# Altium schematic sheet Power_Supply_REV2.SchDoc
size A1; SheetNumber: 3; SheetTotal: 3
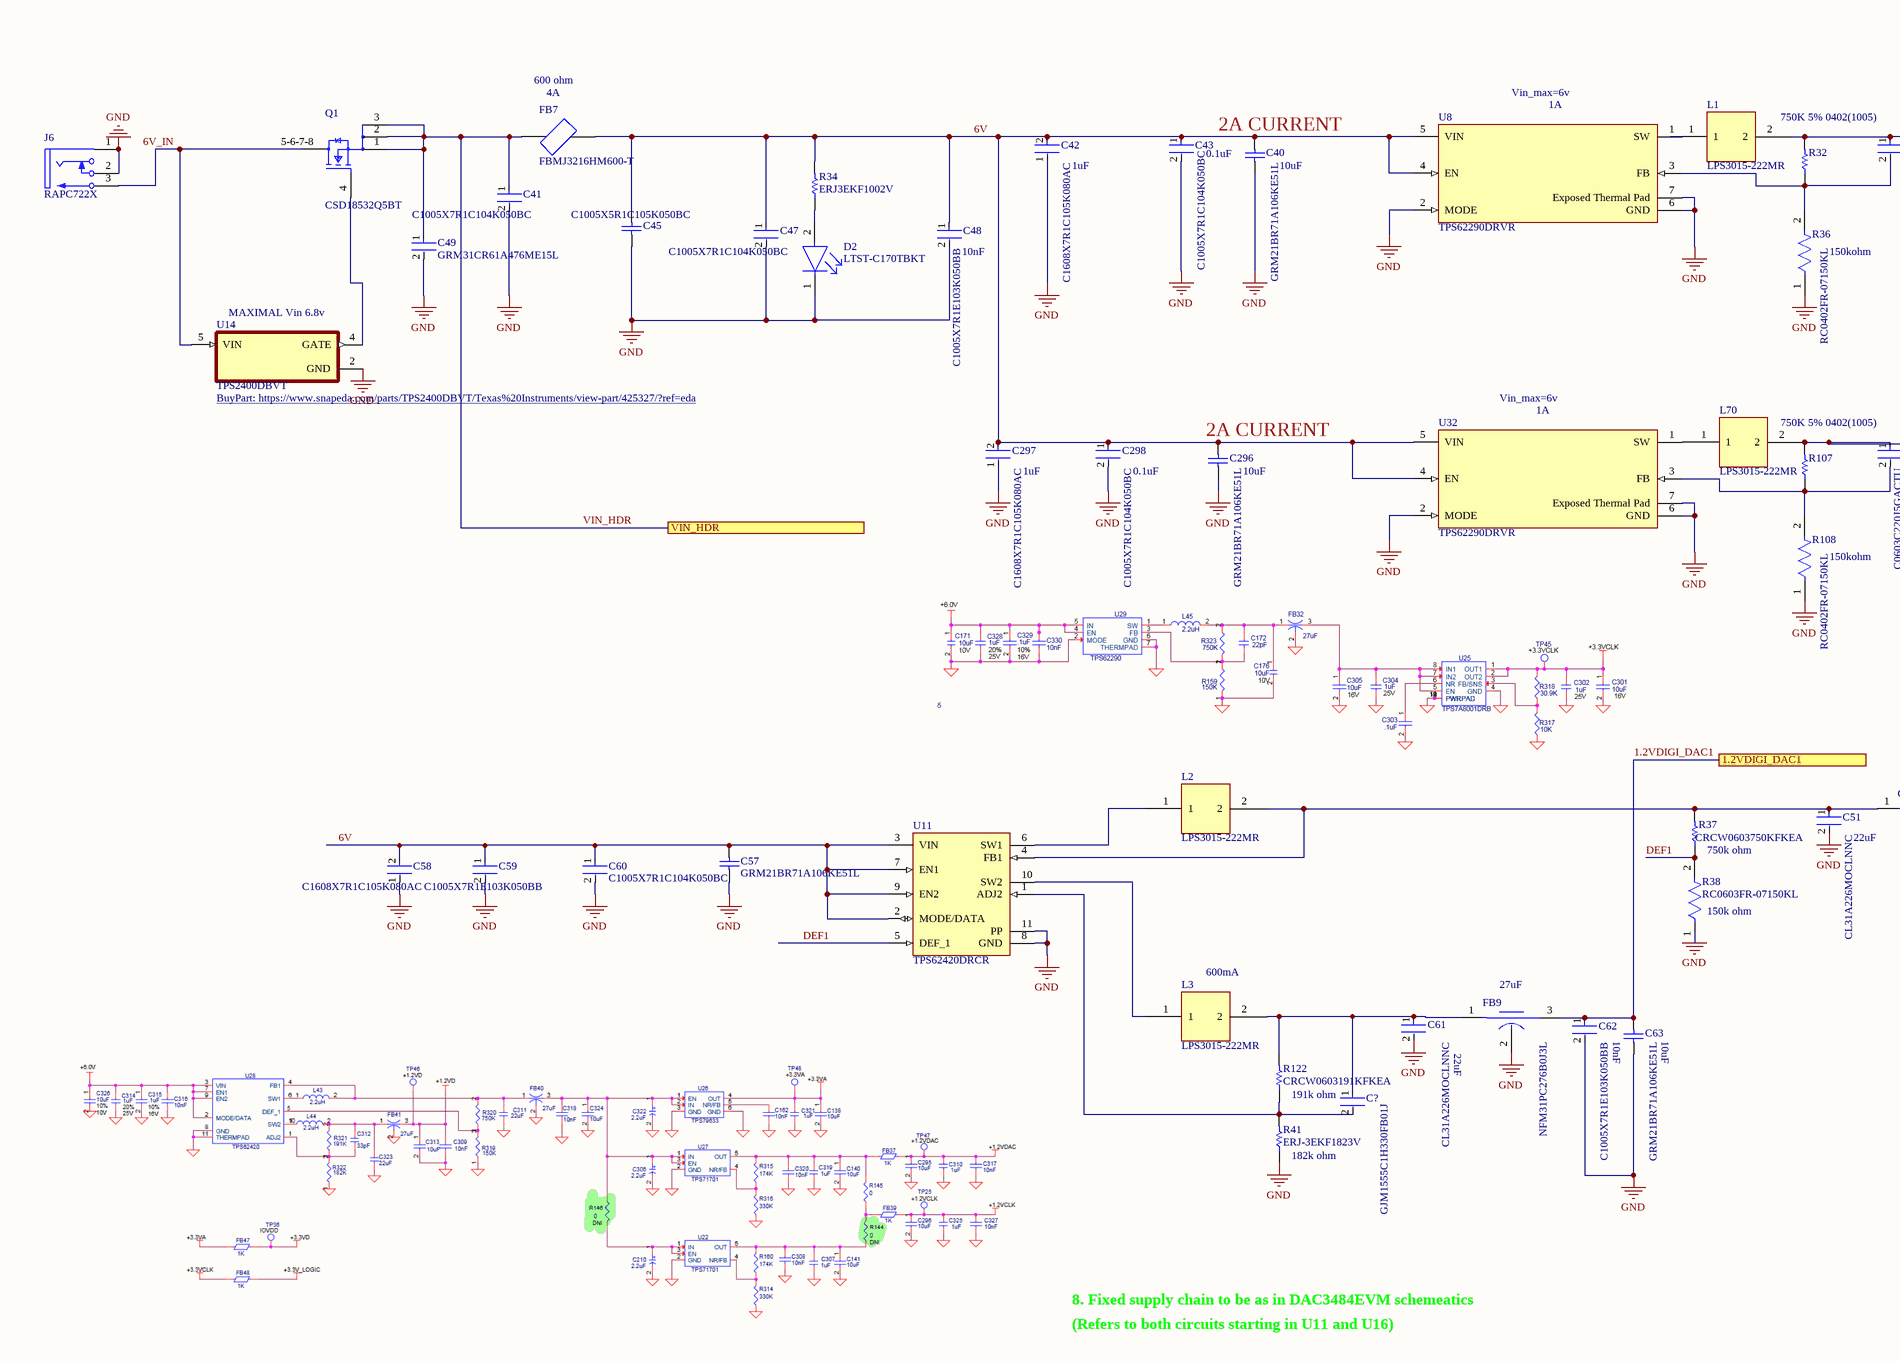
[diagram p0: Power_Supply_REV2.SchDoc, top left]
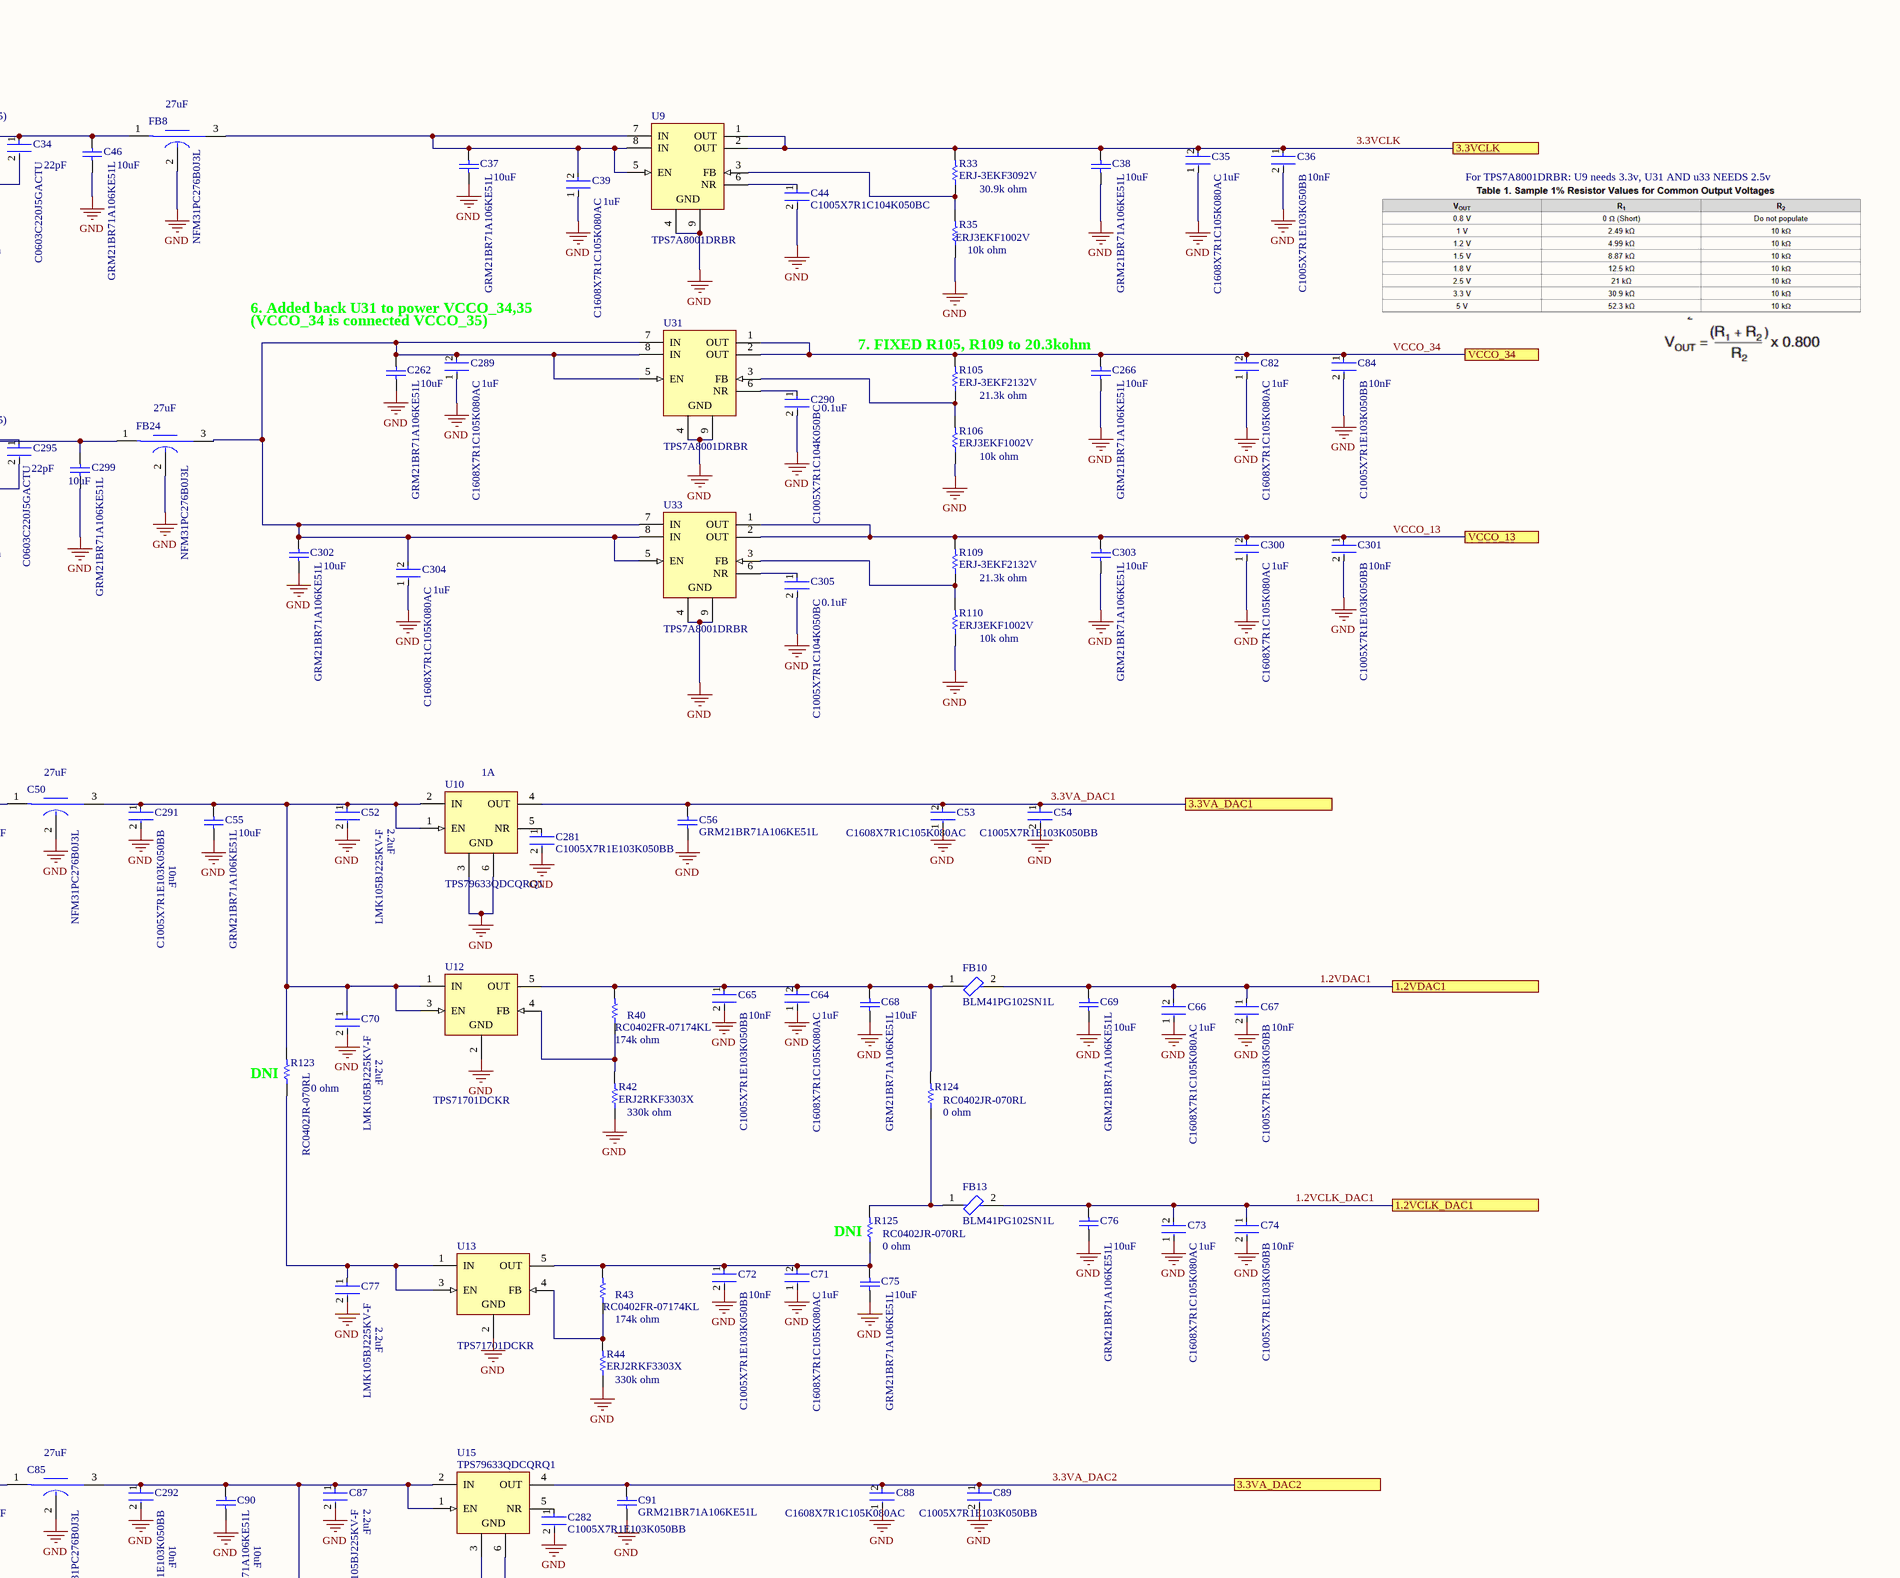
[diagram p1: Power_Supply_REV2.SchDoc, top right]
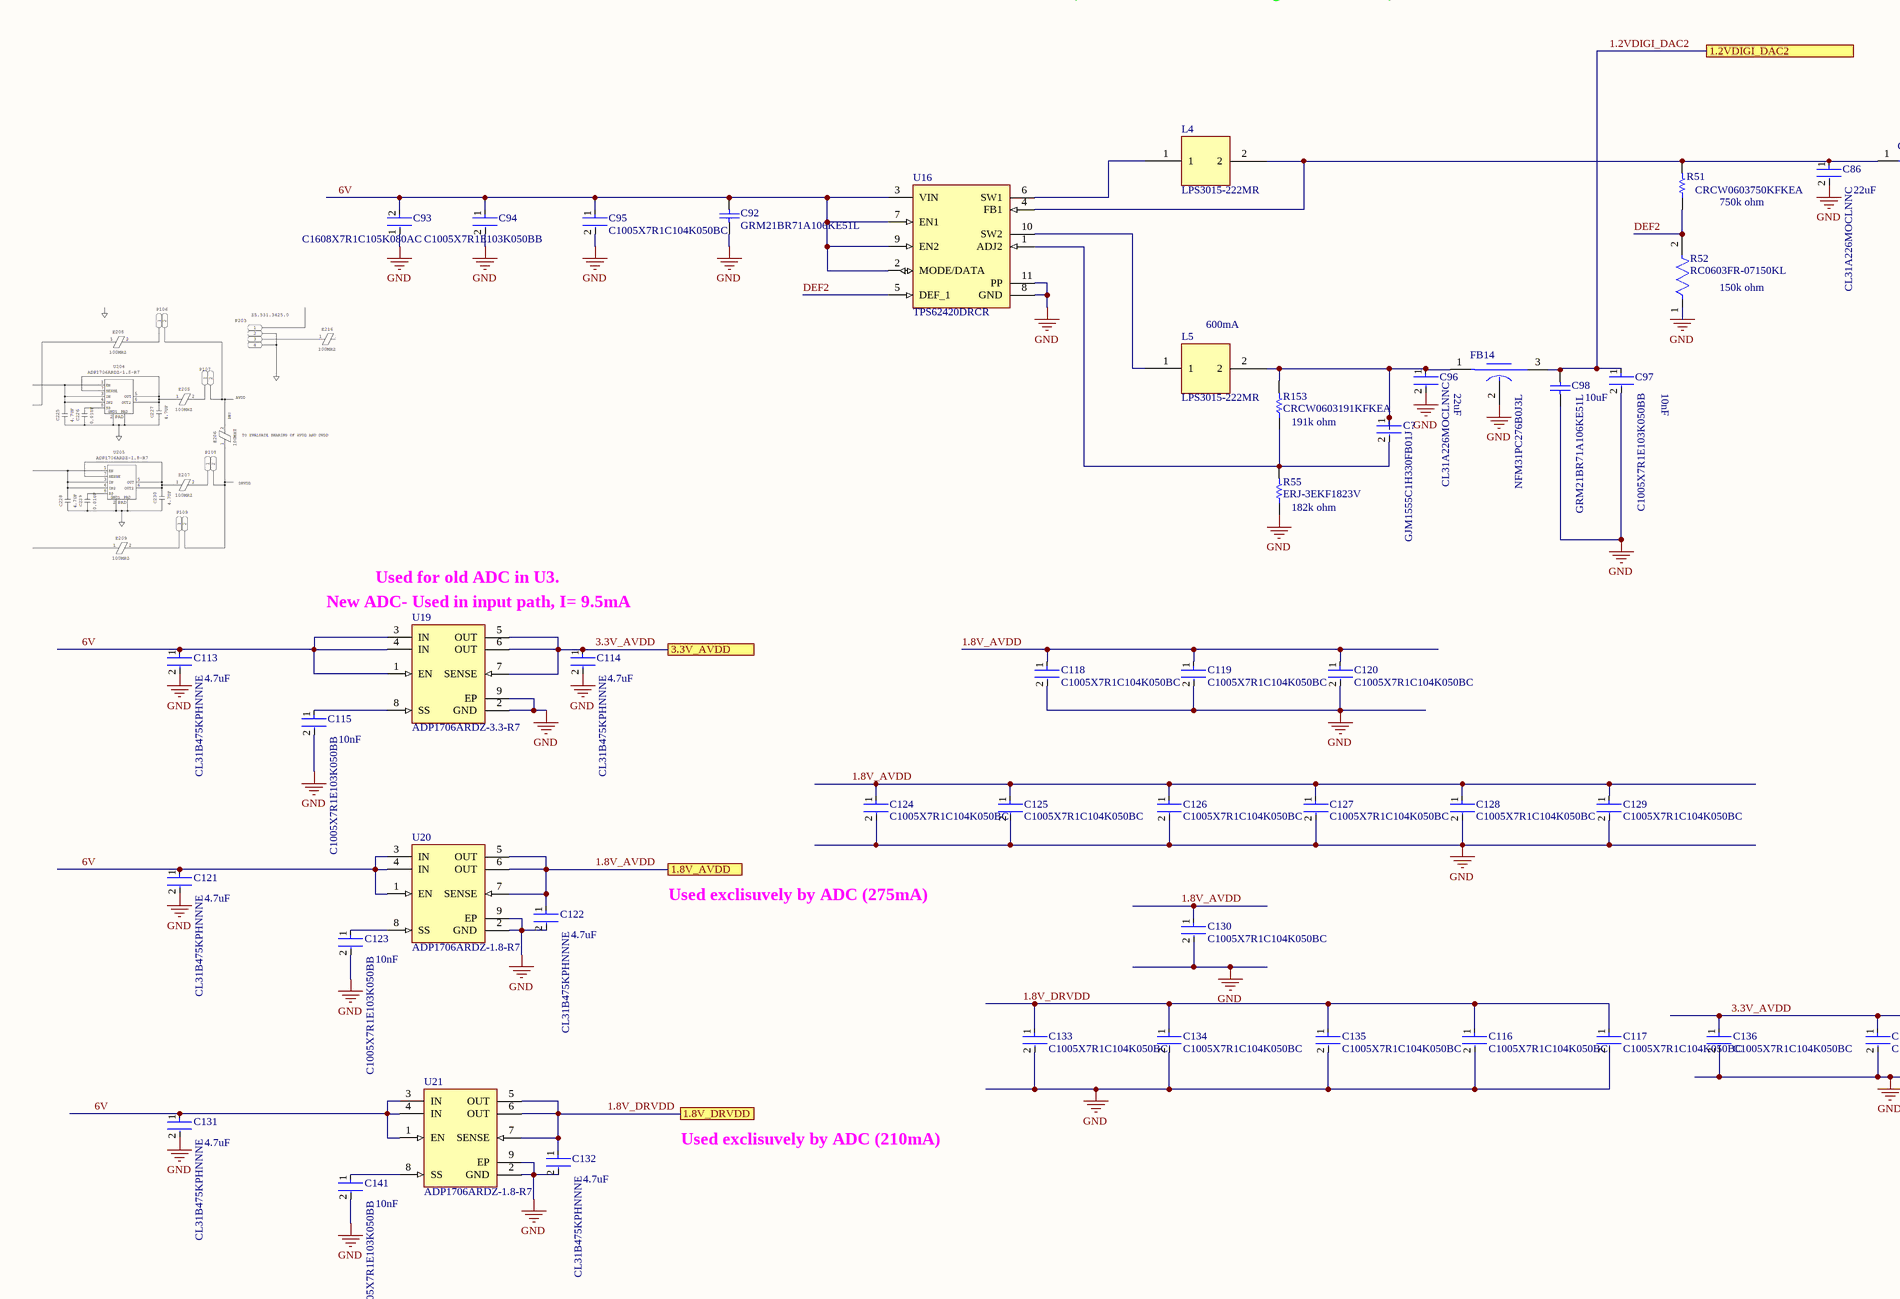
[diagram p2: Power_Supply_REV2.SchDoc, bottom left]
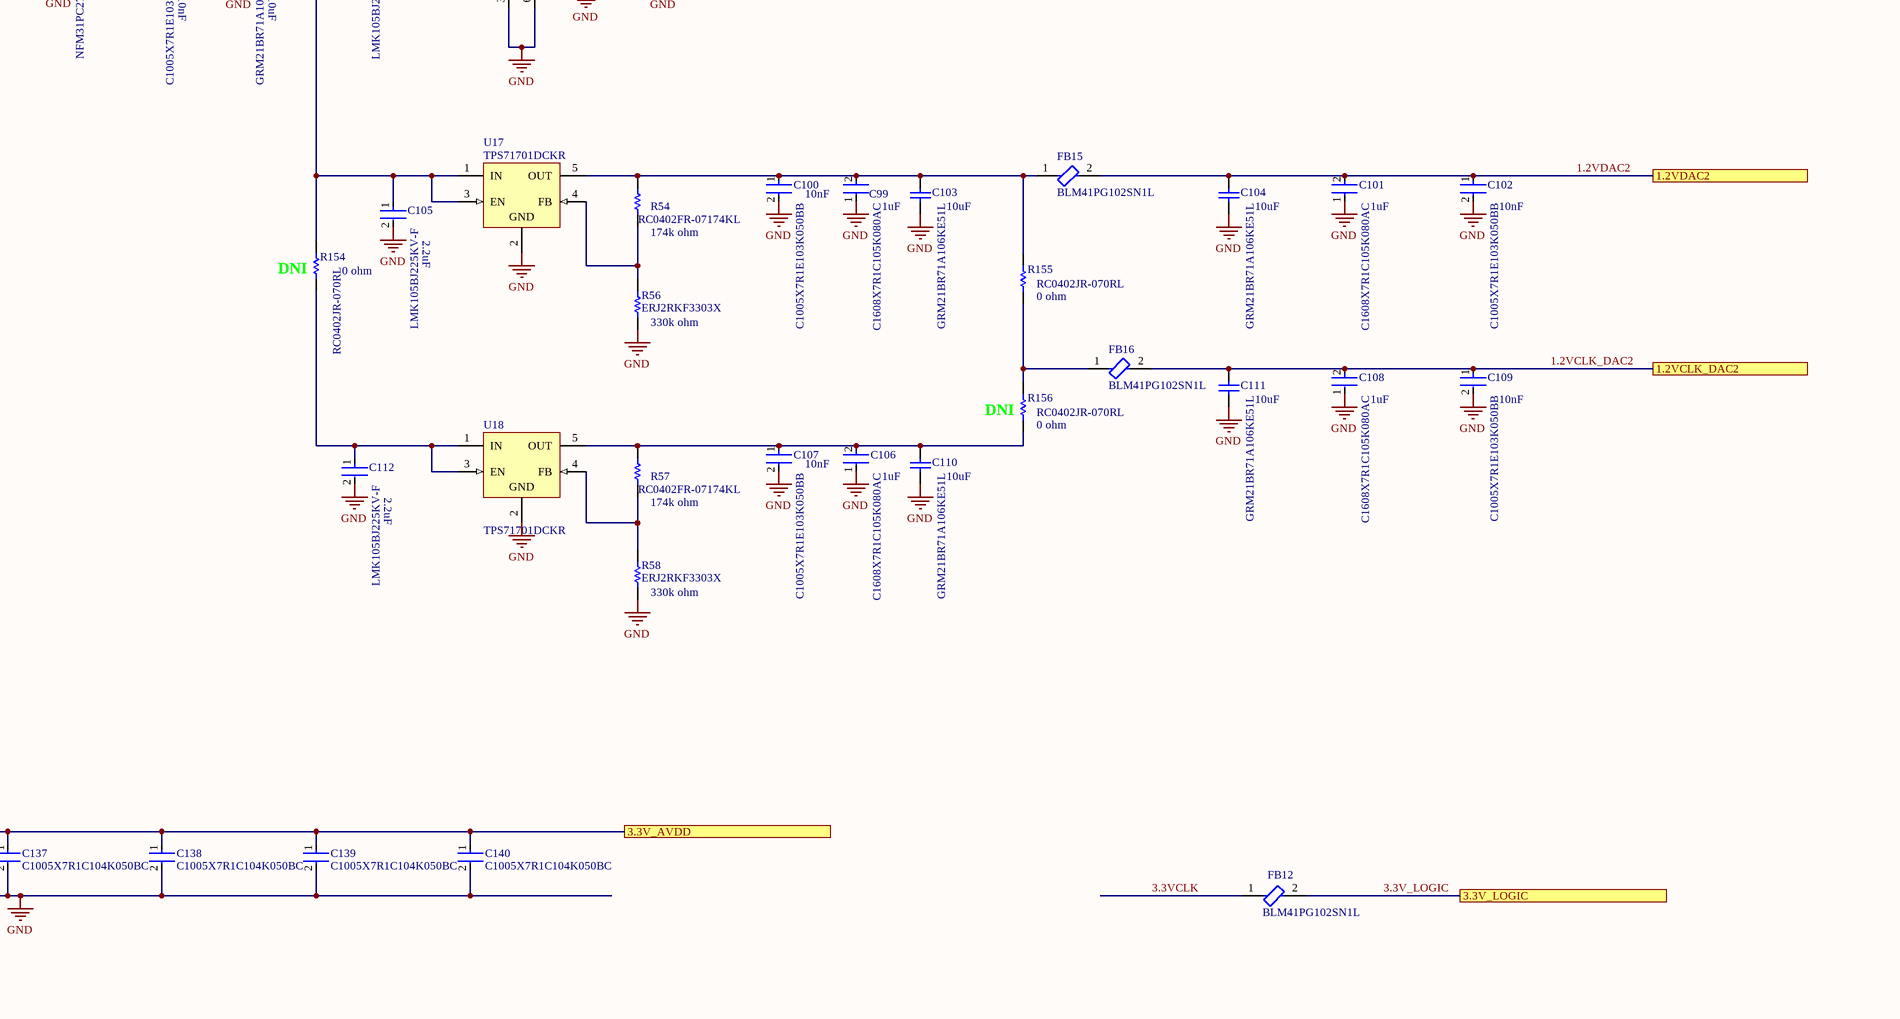
[diagram p3: Power_Supply_REV2.SchDoc, bottom right]

## Parts
(Parts that share a designator on the sheet are numbered #1, #2 ... from top to bottom, then left to right.)
C34  C0603C220J5GACTU  [C0603]
C35  C1608X7R1C105K080AC  [C0603]
C36  C1005X7R1E103K050BB  [C0402]
C37  GRM21BR71A106KE51L  [C0805]
C38  GRM21BR71A106KE51L  [C0805]
C39  C1608X7R1C105K080AC  [C0603]
C40  GRM21BR71A106KE51L  [C0805]
C41  C1005X7R1C104K050BC  [C0402]
C42  C1608X7R1C105K080AC  [C0603]
C43  C1005X7R1C104K050BC  [C0402]
C44  C1005X7R1C104K050BC  [C0402]
C45  C1005X5R1C105K050BC  [C0402]
C46  GRM21BR71A106KE51L  [C0805]
C47  C1005X7R1C104K050BC  [C0402]
C48  C1005X7R1E103K050BB  [C0402]
C49  GRM31CR61A476ME15L  [C1206]
C50  NFM31PC276B0J3L  [FP-NFM31-0_2-MFG]
C51  CL31A226MOCLNNC  [C1206]
C52  LMK105BJ225KV-F  [C0402]
C53  C1608X7R1C105K080AC  [C0603]
C54  C1005X7R1E103K050BB  [C0402]
C55  GRM21BR71A106KE51L  [C0805]
C56  GRM21BR71A106KE51L  [C0805]
C57  GRM21BR71A106KE51L  [C0805]
C58  C1608X7R1C105K080AC  [C0603]
C59  C1005X7R1E103K050BB  [C0402]
C60  C1005X7R1C104K050BC  [C0402]
C61  CL31A226MOCLNNC  [C1206]
C62  C1005X7R1E103K050BB  [C0402]
C63  GRM21BR71A106KE51L  [C0805]
C64  C1608X7R1C105K080AC  [C0603]
C65  C1005X7R1E103K050BB  [C0402]
C66  C1608X7R1C105K080AC  [C0603]
C67  C1005X7R1E103K050BB  [C0402]
C68  GRM21BR71A106KE51L  [C0805]
C69  GRM21BR71A106KE51L  [C0805]
C70  LMK105BJ225KV-F  [C0402]
C71  C1608X7R1C105K080AC  [C0603]
C72  C1005X7R1E103K050BB  [C0402]
C73  C1608X7R1C105K080AC  [C0603]
C74  C1005X7R1E103K050BB  [C0402]
C75  GRM21BR71A106KE51L  [C0805]
C76  GRM21BR71A106KE51L  [C0805]
C77  LMK105BJ225KV-F  [C0402]
C82  C1608X7R1C105K080AC  [C0603]
C84  C1005X7R1E103K050BB  [C0402]
C85  NFM31PC276B0J3L  [FP-NFM31-0_2-MFG]
C86  CL31A226MOCLNNC  [C1206]
C87  LMK105BJ225KV-F  [C0402]
C88  C1608X7R1C105K080AC  [C0603]
C89  C1005X7R1E103K050BB  [C0402]
C90  GRM21BR71A106KE51L  [C0805]
C91  GRM21BR71A106KE51L  [C0805]
C92  GRM21BR71A106KE51L  [C0805]
C93  C1608X7R1C105K080AC  [C0603]
C94  C1005X7R1E103K050BB  [C0402]
C95  C1005X7R1C104K050BC  [C0402]
C96  CL31A226MOCLNNC  [C1206]
C97  C1005X7R1E103K050BB  [C0402]
C98  GRM21BR71A106KE51L  [C0805]
C99  C1608X7R1C105K080AC  [C0603]
C100  C1005X7R1E103K050BB  [C0402]
C101  C1608X7R1C105K080AC  [C0603]
C102  C1005X7R1E103K050BB  [C0402]
C103  GRM21BR71A106KE51L  [C0805]
C104  GRM21BR71A106KE51L  [C0805]
C105  LMK105BJ225KV-F  [C0402]
C106  C1608X7R1C105K080AC  [C0603]
C107  C1005X7R1E103K050BB  [C0402]
C108  C1608X7R1C105K080AC  [C0603]
C109  C1005X7R1E103K050BB  [C0402]
C110  GRM21BR71A106KE51L  [C0805]
C111  GRM21BR71A106KE51L  [C0805]
C112  LMK105BJ225KV-F  [C0402]
C113  CL31B475KPHNNNE  [C1206]
C114  CL31B475KPHNNNE  [C1206]
C115  C1005X7R1E103K050BB  [C0402]
C116  C1005X7R1C104K050BC  [C0402]
C117  C1005X7R1C104K050BC  [C0402]
C118  C1005X7R1C104K050BC  [C0402]
C119  C1005X7R1C104K050BC  [C0402]
C120  C1005X7R1C104K050BC  [C0402]
C121  CL31B475KPHNNNE  [C1206]
C122  CL31B475KPHNNNE  [C1206]
C123  C1005X7R1E103K050BB  [C0402]
C124  C1005X7R1C104K050BC  [C0402]
C125  C1005X7R1C104K050BC  [C0402]
C126  C1005X7R1C104K050BC  [C0402]
C127  C1005X7R1C104K050BC  [C0402]
C128  C1005X7R1C104K050BC  [C0402]
C129  C1005X7R1C104K050BC  [C0402]
C130  C1005X7R1C104K050BC  [C0402]
C131  CL31B475KPHNNNE  [C1206]
C132  CL31B475KPHNNNE  [C1206]
C133  C1005X7R1C104K050BC  [C0402]
C134  C1005X7R1C104K050BC  [C0402]
C135  C1005X7R1C104K050BC  [C0402]
C136  C1005X7R1C104K050BC  [C0402]
C137  C1005X7R1C104K050BC  [C0402]
C138  C1005X7R1C104K050BC  [C0402]
C139  C1005X7R1C104K050BC  [C0402]
C140  C1005X7R1C104K050BC  [C0402]
C141  C1005X7R1E103K050BB  [C0402]
C262  GRM21BR71A106KE51L  [C0805]
C266  GRM21BR71A106KE51L  [C0805]
C281  C1005X7R1E103K050BB  [C0402]
C282  C1005X7R1E103K050BB  [C0402]
C289  C1608X7R1C105K080AC  [C0603]
C290  C1005X7R1C104K050BC  [C0402]
C291  C1005X7R1E103K050BB  [C0402]
C292  C1005X7R1E103K050BB  [C0402]
C295  C0603C220J5GACTU  [C0603]
C296  GRM21BR71A106KE51L  [C0805]
C297  C1608X7R1C105K080AC  [C0603]
C298  C1005X7R1C104K050BC  [C0402]
C299  GRM21BR71A106KE51L  [C0805]
C300  C1608X7R1C105K080AC  [C0603]
C301  C1005X7R1E103K050BB  [C0402]
C302  GRM21BR71A106KE51L  [C0805]
C303  GRM21BR71A106KE51L  [C0805]
C304  C1608X7R1C105K080AC  [C0603]
C305  C1005X7R1C104K050BC  [C0402]
C?#1  GJM1555C1H330FB01J  [FP-GJM155-0_05-IPC_A]
C?#2  GJM1555C1H330FB01J  [FP-GJM155-0_05-IPC_A]
D2  LTST-C170TBKT  [FP-LTST-C170TBKT-MFG]
FB7  FBMJ3216HM600-T  [BEADC3216X130N]
FB8  NFM31PC276B0J3L  [FP-NFM31-0_2-MFG]
FB9  NFM31PC276B0J3L  [FP-NFM31-0_2-MFG]
FB10  BLM41PG102SN1L  [BLM41]
FB12  BLM41PG102SN1L  [BLM41]
FB13  BLM41PG102SN1L  [BLM41]
FB14  NFM31PC276B0J3L  [FP-NFM31-0_2-MFG]
FB15  BLM41PG102SN1L  [BLM41]
FB16  BLM41PG102SN1L  [BLM41]
FB24  NFM31PC276B0J3L  [FP-NFM31-0_2-MFG]
J6  RAPC722X  [SWITCH-RAPC712X-3_V]
L1  LPS3015-222MR  [lps3015]
L2  LPS3015-222MR  [lps3015]
L3  LPS3015-222MR  [lps3015]
L4  LPS3015-222MR  [lps3015]
L5  LPS3015-222MR  [lps3015]
L70  LPS3015-222MR  [lps3015]
Q1  CSD18532Q5BT  [FP-DNK0008A-MFG]
R32  750K 5% 0402(1005)  [R0402]
R33  ERJ-3EKF3092V  [R0603]
R34  ERJ3EKF1002V  [R0603]
R35  ERJ3EKF1002V  [R0603]
R36  RC0402FR-07150KL  [R0402]
R37  CRCW0603750KFKEA  [R0603]
R38  RC0603FR-07150KL  [R0603]
R40  RC0402FR-07174KL  [R0402]
R41  ERJ-3EKF1823V  [R0603]
R42  ERJ2RKF3303X  [R0402]
R43  RC0402FR-07174KL  [R0402]
R44  ERJ2RKF3303X  [R0402]
R51  CRCW0603750KFKEA  [R0603]
R52  RC0603FR-07150KL  [R0603]
R54  RC0402FR-07174KL  [R0402]
R55  ERJ-3EKF1823V  [R0603]
R56  ERJ2RKF3303X  [R0402]
R57  RC0402FR-07174KL  [R0402]
R58  ERJ2RKF3303X  [R0402]
R105  ERJ-3EKF2132V  [R0603]
R106  ERJ3EKF1002V  [R0603]
R107  750K 5% 0402(1005)  [R0402]
R108  RC0402FR-07150KL  [R0402]
R109  ERJ-3EKF2132V  [R0603]
R110  ERJ3EKF1002V  [R0603]
R122  CRCW0603191KFKEA  [RESC1609X50X30LL10T20]
R123  RC0402JR-070RL  [R0402]
R124  RC0402JR-070RL  [R0402]
R125  RC0402JR-070RL  [R0402]
R153  CRCW0603191KFKEA  [RESC1609X50X30LL10T20]
R154  RC0402JR-070RL  [R0402]
R155  RC0402JR-070RL  [R0402]
R156  RC0402JR-070RL  [R0402]
U8  TPS62290DRVR  [FP-DRV0006A-IPC_A]
U9  TPS7A8001DRBR  [DRB0008A_V]
U10  TPS79633QDCQRQ1  [DCQ0006A]
U11  TPS62420DRCR  [DRC0010G]
U12  TPS71701DCKR  [DCK]
U13  TPS71701DCKR  [DCK]
U14  TPS2400DBVT  [DBV0005A]
U15  TPS79633QDCQRQ1  [DCQ0006A]
U16  TPS62420DRCR  [DRC0010G]
U17  TPS71701DCKR  [DCK]
U18  TPS71701DCKR  [DCK]
U19  ADP1706ARDZ-3.3-R7  [ADI-RD-8-2_M]
U20  ADP1706ARDZ-1.8-R7  [ADI-RD-8-2_M]
U21  ADP1706ARDZ-1.8-R7  [ADI-RD-8-2_M]
U31  TPS7A8001DRBR  [DRB0008A_V]
U32  TPS62290DRVR  [FP-DRV0006A-IPC_A]
U33  TPS7A8001DRBR  [DRB0008A_V]

## Ports
1.2VCLK_DAC1, 1.2VCLK_DAC2, 1.2VDAC1, 1.2VDAC2, 1.2VDIGI_DAC1, 1.2VDIGI_DAC2, 1.8V_AVDD, 1.8V_DRVDD, 3.3V_AVDD, 3.3V_LOGIC, 3.3VA_DAC1, 3.3VA_DAC2, 3.3VCLK, VCCO_13, VCCO_34, VIN_HDR

## Nets
GND: C35.1 C36.2 C37.1 C38.1 C39.1 C40.1 C41.2 C42.1 C43.2 C44.2 C45.1 C46.1 C47.2 C48.2 C49.2 C50.2(GND) C51.2 C52.2 C53.1 C54.2 C55.1 C56.1 C57.1 C58.1 C59.2 C60.2 C61.2 C62.2 C63.1 C64.1 C65.2 C66.1 C67.2 C68.1 C69.1 C70.2 C71.1 C72.2 C73.1 C74.2 C75.1 C76.1 C77.2 C82.1 C84.2 C85.2(GND) C86.2 C87.2 C88.1 C89.2 C90.1 C91.1 C92.1 C93.1 C94.2 C95.2 C96.2 C97.2 C98.1 C99.1 C100.2 C101.1 C102.2 C103.1 C104.1 C105.2 C106.1 C107.2 C108.1 C109.2 C110.1 C111.1 C112.2 C113.2 C114.2 C115.2 C116.2 C117.2 C118.2 C119.2 C120.2 C121.2 C122.2 C123.2 C124.2 C125.2 C126.2 C127.2 C128.2 C129.2 C130.2 C131.2 C132.2 C133.2 C134.2 C135.2 C136.2 C137.2 C138.2 C139.2 C140.2 C141.2 C262.1 C266.1 C281.2 C282.2 C289.1 C290.2 C291.2 C292.2 C296.1 C297.1 C298.2 C299.1 C300.1 C301.2 C302.1 C303.1 C304.1 C305.2 D2.1(C) FB8.2(GND) FB9.2(GND) FB14.2(GND) FB24.2(GND) J6.1 J6.2 R35.1 R36.1 R38.1 R41.1 R42.1 R44.1 R52.1 R55.1 R56.1 R58.1 R106.1 R108.1 R110.1 U8.2(MODE) U8.6(GND) U8.7(Exposed_Thermal_Pad) U9.4(GND) U9.9(GND) U10.3(GND) U10.6(GND) U11.8(GND) U11.11(PP) U12.2(GND) U13.2(GND) U14.2(GND) U15.3(GND) U15.6(GND) U16.8(GND) U16.11(PP) U17.2(GND) U18.2(GND) U19.2(GND) U19.9(EP) U20.2(GND) U20.9(EP) U21.2(GND) U21.9(EP) U31.4(GND) U31.9(GND) U32.2(MODE) U32.6(GND) U32.7(Exposed_Thermal_Pad) U33.4(GND) U33.9(GND)
1.2VCLK_DAC1: C73.2 C74.1 C76.2 FB13.2 ; port 1.2VCLK_DAC1
1.2VCLK_DAC2: C108.2 C109.1 C111.2 FB16.2 ; port 1.2VCLK_DAC2
1.2VDAC1: C66.2 C67.1 C69.2 FB10.2 ; port 1.2VDAC1
1.2VDAC2: C101.2 C102.1 C104.2 FB15.2 ; port 1.2VDAC2
1.2VDIGI_DAC1: C62.1 C63.2 FB9.3(Output) ; port 1.2VDIGI_DAC1
1.2VDIGI_DAC2: C97.1 C98.2 FB14.3(Output) ; port 1.2VDIGI_DAC2
1.8V_AVDD: C118.1 C119.1 C120.1 C122.1 C124.1 C125.1 C126.1 C127.1 C128.1 C129.1 C130.1 U20.5(OUT) U20.6(OUT) U20.7(SENSE) ; port 1.8V_AVDD
1.8V_DRVDD: C116.1 C117.1 C132.1 C133.1 C134.1 C135.1 U21.5(OUT) U21.6(OUT) U21.7(SENSE) ; port 1.8V_DRVDD
3.3V_AVDD: C114.1 C136.1 C137.1 C138.1 C139.1 C140.1 U19.5(OUT) U19.6(OUT) U19.7(SENSE) ; port 3.3V_AVDD
3.3V_LOGIC: FB12.2 ; port 3.3V_LOGIC
3.3VA_DAC1: C53.2 C54.1 C56.2 U10.4(OUT) ; port 3.3VA_DAC1
3.3VA_DAC2: C88.2 C89.1 C91.2 U15.4(OUT) ; port 3.3VA_DAC2
3.3VCLK: C35.2 C36.1 C38.2 FB12.1 R33.2 U9.1(OUT) U9.2(OUT) ; port 3.3VCLK
6V: C40.2 C42.2 C43.1 C45.2 C47.1 C48.1 C57.2 C58.2 C59.1 C60.1 C92.2 C93.2 C94.1 C95.1 C113.1 C121.1 C131.1 C296.2 C297.2 C298.1 FB7.2 R34.2 U8.4(EN) U8.5(VIN) U11.2(MODE/DATA) U11.3(VIN) U11.7(EN1) U11.9(EN2) U16.2(MODE/DATA) U16.3(VIN) U16.7(EN1) U16.9(EN2) U19.1(EN) U19.3(IN) U19.4(IN) U20.1(EN) U20.3(IN) U20.4(IN) U21.1(EN) U21.3(IN) U21.4(IN) U32.4(EN) U32.5(VIN)
DEF1: R37.1 R38.2 U11.5(DEF_1)
DEF2: R51.1 R52.2 U16.5(DEF_1)
VCCO_13: C300.2 C301.1 C303.2 R109.2 U33.1(OUT) U33.2(OUT) ; port VCCO_13
VCCO_34: C82.2 C84.1 C266.2 R105.2 U31.1(OUT) U31.2(OUT) ; port VCCO_34
VIN_HDR: C41.1 C49.1 FB7.1 Q1.1(S) Q1.2(S) Q1.3(S) ; port VIN_HDR
NetC34_1: C34.1 C46.2 FB8.1(Input) L1.2 R32.2
NetC34_2: C34.2 R32.1 R36.2 U8.3(FB)
NetC37_2: C37.2 C39.2 FB8.3(Output) U9.5(EN) U9.7(IN) U9.8(IN)
NetC44_1: C44.1 U9.6(NR)
NetC50_1: C50.1(Input) C51.1 L2.2 R37.2 U11.4(FB1)
NetC50_3: C50.3(Output) C52.1 C55.2 C70.1 C291.1 R123.2 U10.1(EN) U10.2(IN) U12.1(IN) U12.3(EN)
NetC61_1: C61.1 C?#1.1 FB9.1(Input) L3.2 R122.2
NetC64_2: C64.2 C65.1 C68.2 FB10.1 R40.2 R124.2 U12.5(OUT)
NetC71_2: C71.2 C72.1 C75.2 R43.2 R125.1 U13.5(OUT)
NetC77_1: C77.1 R123.1 U13.1(IN) U13.3(EN)
NetC85_1: C85.1(Input) C86.1 L4.2 R51.2 U16.4(FB1)
NetC85_3: C85.3(Output) C87.1 C90.2 C105.1 C292.1 R154.2 U15.1(EN) U15.2(IN) U17.1(IN) U17.3(EN)
NetC96_1: C96.1 C?#2.1 FB14.1(Input) L5.2 R153.2
NetC99_2: C99.2 C100.1 C103.2 FB15.1 R54.2 R155.2 U17.5(OUT)
NetC106_2: C106.2 C107.1 C110.2 R57.2 R156.1 U18.5(OUT)
NetC112_1: C112.1 R154.1 U18.1(IN) U18.3(EN)
NetC115_1: C115.1 U19.8(SS)
NetC123_1: C123.1 U20.8(SS)
NetC141_1: C141.1 U21.8(SS)
NetC262_2: C262.2 C289.2 C302.2 C304.2 FB24.3(Output) U31.5(EN) U31.7(IN) U31.8(IN) U33.5(EN) U33.7(IN) U33.8(IN)
NetC281_1: C281.1 U10.5(NR)
NetC282_1: C282.1 U15.5(NR)
NetC290_1: C290.1 U31.6(NR)
NetC295_1: C295.1 C299.2 FB24.1(Input) L70.2 R107.2
NetC295_2: C295.2 R107.1 R108.2 U32.3(FB)
NetC305_1: C305.1 U33.6(NR)
NetC?#1_2: C?#1.2 R41.2 R122.1 U11.1(ADJ2)
NetC?#2_2: C?#2.2 R55.2 R153.1 U16.1(ADJ2)
NetD2_2: D2.2(A) R34.1
NetFB13_1: FB13.1 R124.1 R125.2
NetFB16_1: FB16.1 R155.1 R156.2
NetJ6_3: J6.3 Q1.5-6-7-8(D) U14.5(VIN)
NetL1_1: L1.1 U8.1(SW)
NetL2_1: L2.1 U11.6(SW1)
NetL3_1: L3.1 U11.10(SW2)
NetL4_1: L4.1 U16.6(SW1)
NetL5_1: L5.1 U16.10(SW2)
NetL70_1: L70.1 U32.1(SW)
NetQ1_4: Q1.4(G) U14.4(GATE)
NetR33_1: R33.1 R35.2 U9.3(FB)
NetR40_1: R40.1 R42.2 U12.4(FB)
NetR43_1: R43.1 R44.2 U13.4(FB)
NetR54_1: R54.1 R56.2 U17.4(FB)
NetR57_1: R57.1 R58.2 U18.4(FB)
NetR105_1: R105.1 R106.2 U31.3(FB)
NetR109_1: R109.1 R110.2 U33.3(FB)

## Notes on the sheet
- 600 ohm
- (near FB7) 4A
- (near C40) 2A CURRENT
- (near U8) Vin_max=6v
- (near U8) 1A
- (near FB8) 27uF
- (near C42) 1uF
- 0.1uF
- (near C40) 10uF
- 22pF
- 10uF
- (near C37) 10uF
- 1uF
- 30.9k ohm
- (near C38) 10uF
- (near C35) 1uF
- (near C36) 10nF
- For TPS7A8001DRBR: U9 needs 3.3v, U31 AND u33 NEEDS 2.5v
- (near C48) 10nF
- (near R36) 150kohm
- (near R35) 10k ohm
- (near U14) MAXIMAL Vin 6.8v
- 6. Added back U31 to power VCCO_34,35
- (VCCO_34 is connected VCCO_35)
- (near C289) 1uF
- 7. FIXED R105, R109 to 20.3kohm
- (near C266) 10uF
- (near C82) 1uF
- (near C84) 10nF
- (near C296) 2A CURRENT
- (near U32) Vin_max=6v
- (near U32) 1A
- (near FB24) 27uF
- (near C290) 0.1uF
- 21.3k ohm
- (near C297) 1uF
- (near C298) 0.1uF
- (near C296) 10uF
- (near C295) 22pF
- (near C299) 10uF
- (near R106) 10k ohm
- (near R108) 150kohm
- (near C302) 10uF
- (near C303) 10uF
- (near C300) 1uF
- (near C301) 10nF
- (near C304) 1uF
- (near C305) 0.1uF
- (near R110) 10k ohm
- (near C50) 27uF
- (near U10) 1A
- (near R37) 750k ohm
- 22uF
- 10nF
- (near C55) 10uF
- 2.2uF
- (near R38) 150k ohm
- (near L3) 600mA
- (near FB9) 27uF
- (near C63) 10nF
- (near C63) 10uF
- (near C70) 2.2uF
- (near R40) 174k ohm
- (near C68) 10uF
- (near C67) 10nF
- 191k ohm
- (near R123) DNI
- (near R123) 0 ohm
- (near R42) 330k ohm
- (near R124) 0 ohm
- (near R41) 182k ohm
- (near R125) DNI
- 8. Fixed supply chain to be as in DAC3484EVM schemeatics
- (near R125) 0 ohm
- (near C75) 10uF
- (near C74) 10nF
- (Refers to both circuits starting in U11 and U16)
- (near C77) 2.2uF
- 174k ohm
- (near R44) 330k ohm
- (near C85) 27uF
- (near R51) 750k ohm
- (near C90) 10uF
- (near C87) 2.2uF
- (near L5) 600mA
- (near R52) 150k ohm
- (near C97) 10nF
- (near R153) 191k ohm
- (near R54) 174k ohm
- (near C103) 10uF
- (near C104) 10uF
- (near C101) 1uF
- (near C102) 10nF
- (near R55) 182k ohm
- (near R154) DNI
- (near R154) 0 ohm
- (near R155) 0 ohm
- Used for old ADC in U3.
- (near R56) 330k ohm
- (near U19) New ADC- Used in input path, I= 9.5mA
- (near R156) DNI
- (near R156) 0 ohm
- (near C111) 10uF
- (near C108) 1uF
- (near C109) 10nF
- (near C113) 4.7uF
- (near C114) 4.7uF
- (near C112) 2.2uF
- (near R57) 174k ohm
- (near C110) 10uF
- (near C115) 10nF
- (near R58) 330k ohm
- (near C121) 4.7uF
- (near C122) 4.7uF
- Used exclisuvely by ADC (275mA)
- (near C131) 4.7uF
- (near C132) 4.7uF
- Used exclisuvely by ADC (210mA)
- Labels drawn without touching a wire or pin: 6V_IN

## Library data of the parts
C34 C295 = b4654b650e69147ec39a6b967a45e02: Cap Ceramic 22pF 50V C0G 5% SMD 0603 125°C Paper T/R; Manufacturer: KEMET; Temperature Coefficient: 30ppm/°C; Automotive Grade: Grade 1; Tolerance: 0.05; RoHS: TRUE; Temperature Characteristic: C0G; Capacitance: 22 pF; Device Class L3: Ceramic Capacitors; Digikey Description: Cap Ceramic 22pF 50V C0G 5% SMD 0603 125°C Paper T/R; ComponentLink2URL: https://api.kemet.com/component-edge/download/datasheet/C0603C100J5GACAUTO.pdf; ComponentLink2Description: Datasheet; Automotive: Yes; Temperature: -55°C to +125°C; Temperature Range High: +125°C; Package: C0603C-CF; Device Class L1: Passive Components; Device Class L2: Capacitors; Lead Free: Yes; Value: 22 pF; Manufacturer Part Number: C0603C220J5GACTU; Category: Cap; Mouser Description: Cap Ceramic 22pF 50V C0G 5% SMD 0603 125°C Paper T/R; Voltage Rating: 50 V; Height: 0.87mm; Material: Ceramic; Temperature Range Low: -55°C; Octopart: https://octopart.com/c0603c220j5gactu-kemet-98525
C35 C39 C42 C53 C58 C64 C66 C71 C73 C82 C88 C93 C99 C101 C106 C108 C289 C297 C300 C304 = 236180d848d6139a670b325ea6854c9: Multilayer Ceramic Capacitors 1μF ±10% 16V X7R SMD 0603; Capacitance: 1uF; Mount: Surface Mount; Width: 0.031inch; Radiation Hardening: No; Dielectric Material: Ceramic; Packaging: Tape and Reel; Voltage Rating: 16V; Weight: 7.1E-05oz; Termination: SMD/SMT; Package Quantity: 1; Voltage Rating (DC): 16V; REACH SVHC: No SVHC; Voltage: 16V; Min Operating Temperature: -55°C; Depth: 0.8mm; Height: 0.8mm; Length: 1.6mm; Case Code (Metric): 1608; Thickness: 0.037inch; Lead Free: Lead Free; Resistor Type: Ceramic; RoHS Compliant: Yes; Series: C; Construction: Flat; Max Operating Temperature: 125°C; Tolerance: 10%; Case/Package: 0603; Dielectric: X7R; Case Code (Imperial): 0603
C36 C48 C54 C59 C62 C65 C67 C72 C74 C84 C89 C94 C97 C100 C102 C107 C109 C115 C123 C141 C281 C282 C291 C292 C301 = b4654b650e69147ec39a6b967a45e02: Multilayer Ceramic Capacitors 10nF ±10% 25V X7R SMD 0402; Dielectric Material: Ceramic; Case/Package: 0402; RoHS Compliant: Yes; REACH SVHC: No SVHC; Max Operating Temperature: 125°C; Package Quantity: 1; Capacitance: 10nF; Min Operating Temperature: -55°C; Width: 0.02inch; Radiation Hardening: No; Tolerance: 10%; Mount: Surface Mount; Series: C; Dielectric: X7R; Length: 1mm; Thickness: 0.022inch; Case Code (Imperial): 0402; Case Code (Metric): 1005; Resistor Type: Ceramic; Lead Free: Lead Free; Voltage: 25V; Packaging: Tape and Reel; Weight: 2.3E-05oz; Height: 0.5mm; Number of Pins: 2; Depth: 0.5mm; Voltage Rating (DC): 25V; Termination: SMD/SMT; Voltage Rating: 25V
C37 C38 C40 C46 C55-C57 C63 C68 C69 C75 C76 C90-C92 C98 C103 C104 C110 C111 C262 C266 C296 C299 C302 C303 = CAP: Manufacturer: Murata; Part Number: GRM21BR71A106KE51L
C41 C43 C44 C47 C60 C95 C116-C120 C124-C130 C133-C140 C290 C298 C305 = b4654b650e69147ec39a6b967a45e02: Multilayer Ceramic Capacitors 100nF ±10% 16V X7R SMD 0402; Voltage: 16V; Depth: 0.5mm; Dielectric Material: Ceramic; Lead Free: Lead Free; Number of Pins: 2; Mount: Surface Mount; Radiation Hardening: No; Case/Package: 0402; Voltage Rating: 16V; Capacitance: 100nF; Dielectric: X7R; Min Operating Temperature: -55°C; RoHS Compliant: Yes; Tolerance: 10%; Voltage Rating (DC): 16V; Max Operating Temperature: 125°C; Case Code (Metric): 1005; Height: 0.5mm; Thickness: 0.022inch; Package Quantity: 1; Packaging: Tape and Reel; Termination: SMD/SMT; Construction: Flat; Resistor Type: Ceramic; Length: 1mm; Case Code (Imperial): 0402; Width: 0.02inch; Series: C; Weight: 2.3E-05oz
C45 = CAP-NP-2: Chip Capacitor, 1 uF, +/- 10%, 16 V, -55 to 85 degC, 0402 (1005 Metric), RoHS, Tape and Reel; PCN Part Number: MLCCPartNumberChange30/Nov/2012; Manufacturer: TDK; Capacitance: 1µF; Online Catalog: CSeries,GeneralPurpose; Other Names: 445-4978-6; Temperature Coefficient: X5R; Product Training Modules: CSeriesGeneralApplicationsSEAT,CCV,andTVCLDesignToolsGuidetoReplacinganElectrolyticCapacitorwithanMLCC; Voltage - Rated: 16V; Packaging: Digi-Reel; Tolerance: ±10%; Lead Spacing: -; Size / Dimension: 0.039"Lx0.020"W(1.00mmx0.50mm); Lead Style: -; Operating Temperature: -55degC~85degC; Series: C; Datasheet Version: Oct-13; Applications: GeneralPurpose; Family: CeramicCapacitors; Height - Seated (Max): -; Standard Package: 1; RoHS Information: RoHSCertificate-MLCC; Ratings: -; Package Description: 2-Pin Surface Mount Device, Body 1 x 0.5 mm; Package / Case: 0402(1005Metric); Category: Capacitors; Package Reference: 402; Datasheet URL: https://datasheet.ciiva.com/14482/1756136-14482760.pdf; Manufacturer URL: http://www.tdk.com/; Features: -; Mounting Type: SurfaceMount,MLCC; Thickness (Max): 0.022"(0.55mm)
C49 = 02cd4be3c70576c341d710602a673aa: Chip Multilayer Ceramic Capacitors for General Purpose, 1206, 47uF, X5R, 15%, 20%, 10V; Case/Package: 1206; Radiation Hardening: No; Case Code (Metric): 3216; Max Operating Temperature: 85°C; Capacitance: 47uF; Tolerance: 20%; REACH SVHC: No SVHC; Depth: 1.6mm; Case Code (Imperial): 1206; Termination: SMD/SMT; Voltage Rating (DC): 10V; Package Quantity: 2000; Voltage Rating: 10V; Width: 1.6mm; Lead Free: Lead Free; Voltage: 10V; Packaging: Tape and Reel; Length: 3.2mm; Height: 1.6mm; Number of Pins: 2; Thickness: 0.071inch; Min Operating Temperature: -55°C; Dielectric: X5R; Mount: Surface Mount
C50 C85 FB8 FB9 FB14 FB24 = 968ca41a07abfef6fd4f7114a56c54f: Large Current 3 Terminals Low ESL Chip Multilayer Ceramic Capacitors for General Purpose, 1206, 27uF, 20%, 6.3V; Max Current Rating: 6A; DC Resistance (DCR): 5mR; Insulation Resistance: 20MR; Radiation Hardening: No; Height: 1.3mm; Lead Free: Lead Free; Voltage: 6.3V; Termination: Flat; Mount: Surface Mount; Case/Package: 1206; Capacitance: 27uF; Case Code (Imperial): 1206; Max Voltage Rating (DC): 6.3V; Min Operating Temperature: -40°C; Max Operating Temperature: 85°C; Package Quantity: 1; Length: 3.2mm; Tolerance: 20%; Case Code (Metric): 3216; Packaging: Tape and Reel; Voltage Rating (DC): 6.3V; REACH SVHC: No SVHC; Current Rating: 6A; Width: 1.6mm; Depth: 1.6mm; Current: 6A
C51 C61 C86 C96 = b4654b650e69147ec39a6b967a45e02: Cap Ceramic 22uF 16V X5R ±20% SMD 1206 +85°C Embossed T/R; Height: 0.85mm; Min Operating Temperature: -55°C; Thickness: 0.037inch; Depth: 1.6mm; Length: 3.2mm; Tolerance: 20%; Case Code (Imperial): 1206; Capacitance: 22uF; Package Quantity: 1; Radiation Hardening: No; Case/Package: 1206; Dielectric: X5R; Packaging: Tape and Reel; Voltage: 16V; Case Code (Metric): 3216; Width: 0.063inch; Lead Free: Lead Free; Mount: Surface Mount; Voltage Rating: 16V; Max Operating Temperature: 85°C
C52 C70 C77 C87 C105 C112 = b4654b650e69147ec39a6b967a45e02: None; Tolerance: 10%; Capacitance: 2.2uF; Voltage Rating: 10V; Lead Free: Lead Free; Packaging: Cut Tape; Mount: Surface Mount; Case/Package: 0402; RoHS Compliant: Yes; Min Operating Temperature: -55°C; Case Code (Imperial): 0402; Max Operating Temperature: 85°C; Case Code (Metric): 1005
C113 C114 C121 C122 C131 C132 = b4654b650e69147ec39a6b967a45e02: Cap Ceramic 4.7uF 10V X7R ±10% SMD 1206 +125°C Embossed T/R; Case Code (Metric): 3216; Height: 1.6mm; Contact Plating: Tin; Voltage Rating: 10V; Packaging: Tape and Reel; Case/Package: 1206; Package Quantity: 1; Length: 3.2mm; Material: Ceramic; Voltage Rating (DC): 10V; Dielectric: X7R; Depth: 1.6mm; Capacitance: 4.7uF; Lead Free: Lead Free; Min Operating Temperature: -55°C; Thickness: 0.071inch; Case Code (Imperial): 1206; Width: 0.063inch; Tolerance: 10%; Mount: Surface Mount; Voltage: 10V; Radiation Hardening: No; Max Operating Temperature: 125°C
C?#1 C?#2 = CMP-06035-005614-1: Multi-Layer Ceramic Capacitor 33pF C0G  ±1% 0402 Paper T/R
D2 = 8706943c75ba83719d021d2fdc84c58: LED BLUE CLEAR SMD; Luminous Intensity: 180mcd; Number of LEDs: 1; Lens Style: Diffused; Power Rating: 76mW; Lens Color: Colorless; Forward Voltage: 3.8V; Viewing Angle: 130°; Reverse Voltage: 5V; Forward Current: 20mA; Dominant Wavelength: 475nm; Wavelength: 468nm; Radiation Hardening: No; Illumination Color: Blue; Case Code (Metric): 2012; Max Operating Temperature: 80°C; Case Code (Imperial): 0805; Min Operating Temperature: -20°C; Height: 1.1mm; Color: Blue; Package Quantity: 1; Lens Transparency: Clear; Number of Pins: 2; Lead Free: Lead Free; Mount: Surface Mount; Length: 2mm; Depth: 1.25mm; Number of Elements: 1; Case/Package: 0805; Power Dissipation: 76mW; Width: 1.25mm; Test Current: 20mA; Packaging: Tape and Reel
FB7 = FBMJ3216HM600-T: Ind Chip Bead 60Ohm 25% Ferrite 4A 1206 T/R; Package: None; Price: None; Value: *; MP: FBMJ3216HM600-T; Availability: Unavailable
FB10 FB12 FB13 FB15 FB16 = 5f30dd21d616792df468990f7003faa: Ferrite Bead, 1806, 1000Ω @ 100MHz, 25%, 0.09Ω, 1.5A; Manufacturer Series: BLM41P; Number of Lines: 1; DC Resistance (DCR): 90mR; Material: Steel; Impedance: 1kR; Shielding: Unshielded; Case Code (Metric): 4516; REACH SVHC: No SVHC; Case/Package: 1806; Core Material: Ferrite; Max Operating Temperature: 125°C; Terminal Finish: Tin; Radiation Hardening: No; Termination: SMD/SMT; DC Current: 1.5A; Current Rating: 1.5A; Tolerance: 25%; Frequency: 100MHz; Number of Pins: 2; DC Resistance-Max: 90mR; Series: BLM41P; Min Operating Temperature: -55°C; Length: 4.5mm; Number of Circuits: 1; Case Code (Imperial): 1806; Width: 1.6mm; Number of Functions: 1; Military Standard: Not; Packaging: Tape and Reel; Lead Free: Lead Free; Max DC Current: 1.5A; Package Quantity: 1; Max Current Rating: 1.5A; Depth: 1.6mm; Test Frequency: 100MHz; Height: 1.6mm
J6 = SWITCH-RAPC712X-3: Power Jack, 5 A, 3-Pin THD, RoHS, Bulk; Manufacturer: Switchcraft; Current Rating: 5A; Plug/Mating Plug Diameter: 2.1mmID,5.5mmOD; Gender: Male; Mating Products: S765-ND / -CONNPLUGMINIPWR2CONDWHT/RED / S760K-ND / -CONNPOWERPLUGMINI.08"BLACK / SC1052-ND / -CONNPOWERPLUGMINIBLACK; Number of Positions/Contacts: 2Conductors,2Contacts; Internal Switch(s): SingleSwitch,NormallyClosed; Shielding: Unshielded; Catalog Drawings: RAPC7(1,2)2XSide / RAPC7(1,2)2XTop; Dynamic Catalog: SwitchcraftInc; Other Names: Q2287470A / RAPC722X-ND / SC1313; Standard Package: 2,500; Termination: SolderEyelet(s); Family: Barrel-PowerConnectors; Housing Color: Black; Housing Material: Thermoplastic; RoHS Information: SwitchcraftRoHSInfo; Color: Black; Contact Material - Plating: Nickel; Mounting Type: ThroughHole,RightAngle; Manufacturer URL: http://www.switchcraft.com/; Contact Material: Brass; Datasheet Version: Rev. A, 08/2005; Connector Type: Jack; Category: Connectors,Interconnects; Datasheet URL: http://www.mouser.com/ds/2/393/rapc722x_cd-371352.pdf
L1-L5 L70 = Component_1
Q1 = 7382af88e928fdc71488234cfaaf11c: MOSFET N-CH 60V 100A 8VSON; Fall Time: 3.1ns; Max Power Dissipation: 3.2W; Rise Time: 7.2ns; Element Configuration: Single; Turn-Off Delay Time: 22ns; Input Capacitance: 5.07nF; Rds On Max: 3.2mR; Gate to Source Voltage (Vgs): 20V; Turn-On Delay Time: 5.8ns; Packaging: Tape and Reel; Continuous Drain Current (ID): 100A; Min Operating Temperature: -55°C; Number of Pins: 8; Contact Plating: Tin; Lead Free: Contains Lead; Drain to Source Voltage (Vdss): 60V; RoHS Compliant: Yes; Max Operating Temperature: 150°C; Mount: Surface Mount
R32 R107 = RES: 750K 0.063W 5% 0402 (1005 Metric)  SMD; Case-Metric: 1005; Case-EIA: 0402; Value: 750000.00 Ohm; Technology: SMT; Tolerance: 5 %; Power: 0.063 W
R33 R41 R42 R44 R55 R56 R58 = RES: Manufacturer: Panasonic
  R33: Part Number: ERJ-3EKF3092V
  R41 R55: Part Number: ERJ-3EKF1823V
  R42 R44 R56 R58: Part Number: ERJ2RKF3303X
R34 R35 R106 R110 = RES-2: Chip Resistor, 10 KOhm, +/- 1%, 0.1 W, -55 to 155 degC, 0603 (1608 Metric), RoHS, Tape and Reel; Manufacturer: Panasonic; Voltage Rating: 75V; Case\/Package: 0603; Power Rating: 100mW; Resistance: 10KOhm; Temperature Coefficient: 100ppm\/degreesC; Number of Pins: 2; Package Reference: 603; Depth: 0.8mm; Mount: SurfaceMount; Package Description: 2-Pin Surface Mount Device, Body 1.6 x 0.85 mm; Datasheet Version: 02/2017; Length: 1.6mm; Lead Free: LeadFree; Height: 0.45mm; Number of Terminations: 2; Max Power Dissipation: 100mW; Min Operating Temperature: -55degC; Datasheet URL: https://industrial.panasonic.com/cdbs/www-data/pdf/RDA0000/AOA0000C304.pdf; Termination: SMD/SMT; Case Code (Metric): 1608; Case Code (Imperial): 0603; Tolerance: 1%; Max Operating Temperature: 155degC; RoHSCompliant: true; Voltage Rating (DC): 75V; Radiation Hardening: No; Packaging: TapeandReel; Composition: ThickFilm; Mounting Technology: SurfaceMount; Manufacturer URL: http://www.panasonic.com/; Width: 0.031inch; REACH SVHC: NoSVHC; Contact Plating: Tin; Military Standard: Not; Package Quantity: 1
R36 R108 = 1029c3af85768c4190bb7ad29bc67b5: RES 150K OHM 1% 1/16W 0402; Voltage Rating: 50V; Resistance: 150kR; Max Power Dissipation: 63mW; Temperature Coefficient: 100ppm/°C; Package Quantity: 1; Features: Moisture Resistant; Case Code (Imperial): 0402; Case Code (Metric): 1005; Tolerance: 1%; Max Operating Temperature: 155°C; Termination: SMD/SMT; Number of Terminations: 2; Width: 0.5mm; Case/Package: 0402; Min Operating Temperature: -55°C; Length: 1mm; Military Standard: Not; Construction: Rectangular; Working Voltage: 50V; Resistor Type: Thick Film; Technology: THICK FILM; Number of Pins: 2; Lead Free: Lead Free; Power Rating: 63mW; Packaging: Tape and Reel; Resistance Tolerance: 1%; Series: RC; Voltage Rating (DC): 50V; REACH SVHC: No SVHC; RoHS Compliant: Yes; Depth: 0.5mm; Height: 0.016inch
R37 R51 = RES: Manufacturer: Vishay Dale; Part Number: CRCW0603750KFKEA
R38 R52 = 1029c3af85768c4190bb7ad29bc67b5: NexarPartId: 40301068; Resistance: 150kΩ; Voltage Rating (AC): 50V; Max Power Dissipation: 100mW; Tolerance: 1%; Temperature Coefficient: 100ppm/°C; Max Operating Temperature: 155°C; Features: Moisture Resistant; Width: 800µm; Case Code (Imperial): 0603; Depth: 800µm; Number of Terminations: 2; Voltage Rating (DC): 50V; Mount: Surface Mount; Termination: SMD/SMT; REACH SVHC: No SVHC; Military Standard: Not; Case Code (Metric): 1608; Schedule B: 8533210045, 8533210045; Number of Pins: 2; Min Operating Temperature: -55°C; Lead Free: Lead Free; Packaging: Tape & Reel; Length: 1.6mm; Height: 450µm; Power Rating: 100mW; Voltage Rating: 50V; Case/Package: 0603; Composition: Thick Film; RoHS: Compliant
R40 R43 R54 R57 = RES: Manufacturer: Yageo; Part Number: RC0402FR-07174KL
R105 R109 = RES: Manufacturer: Panasonic; Part Number: ERJ-3EKF3092V
R122 R153 = CMP-2000-02965-1: Manufacturer: Vishay Dale; Part Number: CRCW0603191KFKEA
R123-R125 R154-R156 = RES: Manufacturer: Yageo / Phycomp; Part Number: RC0402JR-070RL
U8 U32 = e18bba32e79127f802312c6d0d2e879: IC REG BUCK ADJUSTABLE 1A 6SON; Max Input Voltage: 6V; Switching Frequency: 2.25MHz; Min Input Voltage: 2.3V; Synchronous Rectifier: Yes; Quiescent Current: 15uA; Number of Outputs: 1; Min Output Voltage: 600mV; Mount: Surface Mount; Lead Free: Lead Free; Max Output Voltage: 6V; Number of Pins: 6; Max Output Current: 1A; REACH SVHC: No SVHC; RoHS Compliant: Yes; Output Type: Adjustable; Series: -; Case/Package: SON; Weight: 0.000342oz; Max Operating Temperature: 85°C; Output Current: 1A; Operating Supply Voltage: 6V; Package Quantity: 1; Min Operating Temperature: -40°C; Output Voltage: 6V; Packaging: Tape and Reel; Radiation Hardening: No
U9 U31 U33 = TI-TPS7A8X01DRB8-1750X1500TP: Single Output LDO, 1 A, Adjustable 0.8 to 6 V Output, 2.2 to 6.5 V Input, with High-Bandwidth PSRR, 8-pin SON (DRB), -40 to 125 degC, Green (RoHS & no Sb/Br); Manufacturer: Texas Instruments; Iout(Max)(A): 1; Vin(Max)(V): 6.5; SubFamily: Single Channel LDO; Vdo(Typ)(mV): 170; Vout Adj(Min)(V): 0.8; Vin(Min)(V): 2.2; Accuracy(%): 3; Iq(Typ)(mA): 0.04; Vout Adj(Max)(V): 6; DatasheetVersion: SBVS135G; ComponentLink1Description: Manufacturer URL; ComponentLink1URL: http://www.ti.com/; PartNumber: TPS7A8001DRBR; Eco-Plan: Green (RoHS & no Sb/Br); PackageVersion: 4203482-2/K; PackageReference: DRB0008A; ComponentLink3Description: Package Specification; PackageDescription: 8-Pin Plastic Small Outline, Body 3 x 3 mm, Pitch 0.65 mm; ComponentLink2URL: http://www.ti.com/general/docs/lit/getliterature.tsp?genericPartNumber=TPS7A8001&fileType=pdf; ComponentLink2Description: Datasheet; Mounting Technology: Surface Mount; ComponentLink3URL: http://www.ti.com/litv/pdf/mpds118h
U10 U15 = TI-TPS7XXXXXXXX: Single Output High PSRR LDO, 1 A, Fixed 3.3 V Output, 2.7 to 5.5 V Input, 6-pin SOT-223 (DCQ), -40 to 125 degC, Green (RoHS & no Sb/Br); Manufacturer: Texas Instruments; PartNumber: TPS79633DCQ; SubFamily: Single Channel LDO; Iq(Typ)(mA): 0.26; Vin(Max)(V): 5.5; Fixed Output Options(V): 3.3; Vin(Min)(V): 2.7; Vdo(Typ)(mV): 220; Accuracy(%): 2; Iout(Max)(A): 1; Mounting Technology: Surface Mount; ComponentLink2URL: http://www.ti.com/general/docs/lit/getliterature.tsp?genericPartNumber=TPS79633&fileType=pdf; PackageVersion: 4202109/D; PackageReference: DCQ0006A; DatasheetVersion: SLVS351N; ComponentLink2Description: Datasheet; ComponentLink3Description: Package Specification; Vout Adj(Max)(V): 3.3; Eco-Plan: Green (RoHS & no Sb/Br); ComponentLink1URL: http://www.ti.com/; ComponentLink3URL: http://www.ti.com/litv/pdf/mpds098c; Vout Adj(Min)(V): 3.3; ComponentLink1Description: Manufacturer URL; PackageDescription: 6-Pin Plastic Small Outline, Body 3.5 x 6.5 mm, Pitch 1.27 mm
U11 U16 = TI-TPS62420DRC10-2400X1650TP: Buck Adjustable Regulator with 2.5 to 6 V Input and 0.6 to 6 V Output, -40 to 85 degC, 10-Pin SON (DRC), Green (RoHS & no Sb/Br); Manufacturer: Texas Instruments; Iout2(Max)(A): 1; Vout(Min)(V): 0.6; Vin(Min)(V): 2.5; SubFamily: Step-Down Regulator; Regulated Outputs(#): 2; Dynamic Voltage Scaling: TRUE; Iq(Typ)(mA): 0.032; Vout(Max)(V): 6; Rating: Catalog; Duty Cycle(Max)(%): 100; ComponentLink2URL: http://www.ti.com/litv/pdf/mpds117k; ComponentLink1URL: http://www.ti.com/general/docs/lit/getliterature.tsp?genericPartNumber=TPS62420&fileType=pdf; Switch Current Limit(Typ)(A): 1; PartNumber: TPS62420DRCR; ComponentLink2Description: Package Specification; Topology: Buck; Mounting Technology: Surface Mount; PackageVersion: revL, Sep-2011; ComponentLink1Description: Datasheet; Iout(Max)(A): 0.6; PackageDescription: 10-Pin Plastic Small Outline No-Lead, 3 x 3 x 1 mm Body, 0.5 mm Pitch, Exposed Pad; ComponentLink3URL: Samples URL:http://www.ti.com/product/tps62420#samples; Eco-Plan: Green (RoHS & no Sb/Br); ComponentLink3Description: URL Link1; PackageReference: DRC0010J; Vout2(Max)(V): 6; DatasheetVersion: SLVS676C; Synchronous Rectification: TRUE; Vin(Max)(V): 6; Vout2(Min)(V): 0.6
U12 U13 U17 U18 = TI-TPS7XX01-5: Single Output LDO, 150 mA, Adjustable 0.9 to 6.2 V Output, 2.5 to 6.5 V Input, with High-Bandwidth PSRR, 5-pin SC70 (DCK), -40 to 125 degC, Green (RoHS & no Sb/Br); Manufacturer: Texas Instruments; Vout Adj(Max)(V): 6.2; Vin(Max)(V): 6.5; SubFamily: Single Channel LDO; Iout(Max)(A): 0.15; Vdo(Typ)(mV): 170; Vin(Min)(V): 2.5; Vout Adj(Min)(V): 0.9; Accuracy(%): 3; Iq(Typ)(mA): 0.05; ComponentLink2URL: http://www.ti.com/general/docs/lit/getliterature.tsp?genericPartNumber=TPS71701&fileType=pdf; Mounting Technology: Surface Mount; PackageReference: DCK0005A; DatasheetVersion: SBVS068G; PackageVersion: 4093553-3/G; ComponentLink3Description: Package Specification; ComponentLink3URL: http://www.ti.com/litv/pdf/mpds025f; ComponentLink1Description: Manufacturer URL; ComponentLink1URL: http://www.ti.com/; PackageDescription: 5-Pin Plastic Small-Outline, Body 2 x 1.25 mm, Pitch 0.65 mm; Eco-Plan: Green (RoHS & no Sb/Br); PartNumber: TPS71701DCKR; ComponentLink2Description: Datasheet; Code_JEDEC: MO-203
U14 = TPS2400DBVT: 5.5-V over voltage protection controller with 100-V input transient protection 5-SOT-23 -40 to 85; MF: Texas Instruments; Texas_Instruments-Purchase-URL: https://snapeda.com/shop?store=Texas+Instruments&id=425327; SnapEDA_Link: https://www.snapeda.com/parts/TPS2400DBVT/Texas%20Instruments/view-part/425327/?ref=snap; Value: *; MP: TPS2400DBVT; DigiKey-Purchase-URL: https://snapeda.com/shop?store=DigiKey&id=425327; Package: SOT-23-5 Texas Instruments; Price: None; Availability: Good; Mouser-Purchase-URL: https://snapeda.com/shop?store=Mouser&id=425327; BuyPart: https://www.snapeda.com/parts/TPS2400DBVT/Texas%20Instruments/view-part/425327/?ref=eda
U19 = ADI-ADP1706-RD-8-2: 1 A, Low Dropout, CMOS Linear Regulator, 2.5 to 5.5 V Vin, 3.3 V Vout, Industrial, 8-pin SOIC (RD-8-2), Reel; Manufacturer: Analog Devices; ComponentLink3Description: Package Specification; ComponentLink1URL: http://www.analog.com/en/index.html; ComponentLink3URL: http://www.analog.com/static/imported-files/packages/62062404671038RD_8_2.pdf; ComponentLink2Description: Datasheet; DatasheetVersion: Rev. 0; ComponentLink1Description: Manufacturer URL; PackageDescription: 8-Pin Standard Small Outline Package, Body 4.9 x 3.9 mm, Pitch 1.27 mm; PartNumber: ADP1706ARDZ-3.3-R7; Code_JEDEC: MS-012-AA; ComponentLink4Description: URL Link1; Mounting Technology: Surface Mount; Packing: Reel; ComponentLink4URL: Product URL:http://www.analog.com/en/ADP1706/productSearch.html; PackageVersion: Jan-05; ComponentLink2URL: http://www.analog.com/static/imported-files/data_sheets/ADP1706_1707_1708.pdf; PackageReference: RD-8-2
U20 U21 = ADI-ADP1706-RD-8-2: 1 A, Low Dropout, CMOS Linear Regulator, 2.5 to 5.5 V Vin, 1.8 V Vout, Industrial, 8-pin SOIC (RD-8-2), Reel; Manufacturer: Analog Devices; ComponentLink3Description: Package Specification; PackageDescription: 8-Pin Standard Small Outline Package, Body 4.9 x 3.9 mm, Pitch 1.27 mm; ComponentLink4URL: Product URL:http://www.analog.com/en/ADP1706/productSearch.html; ComponentLink3URL: http://www.analog.com/static/imported-files/packages/62062404671038RD_8_2.pdf; Mounting Technology: Surface Mount; PackageReference: RD-8-2; ComponentLink4Description: URL Link1; ComponentLink1URL: http://www.analog.com/en/index.html; ComponentLink2URL: http://www.analog.com/static/imported-files/data_sheets/ADP1706_1707_1708.pdf; Packing: Reel; PartNumber: ADP1706ARDZ-1.8-R7; PackageVersion: Jan-05; DatasheetVersion: Rev. 0; ComponentLink2Description: Datasheet; ComponentLink1Description: Manufacturer URL; Code_JEDEC: MS-012-AA